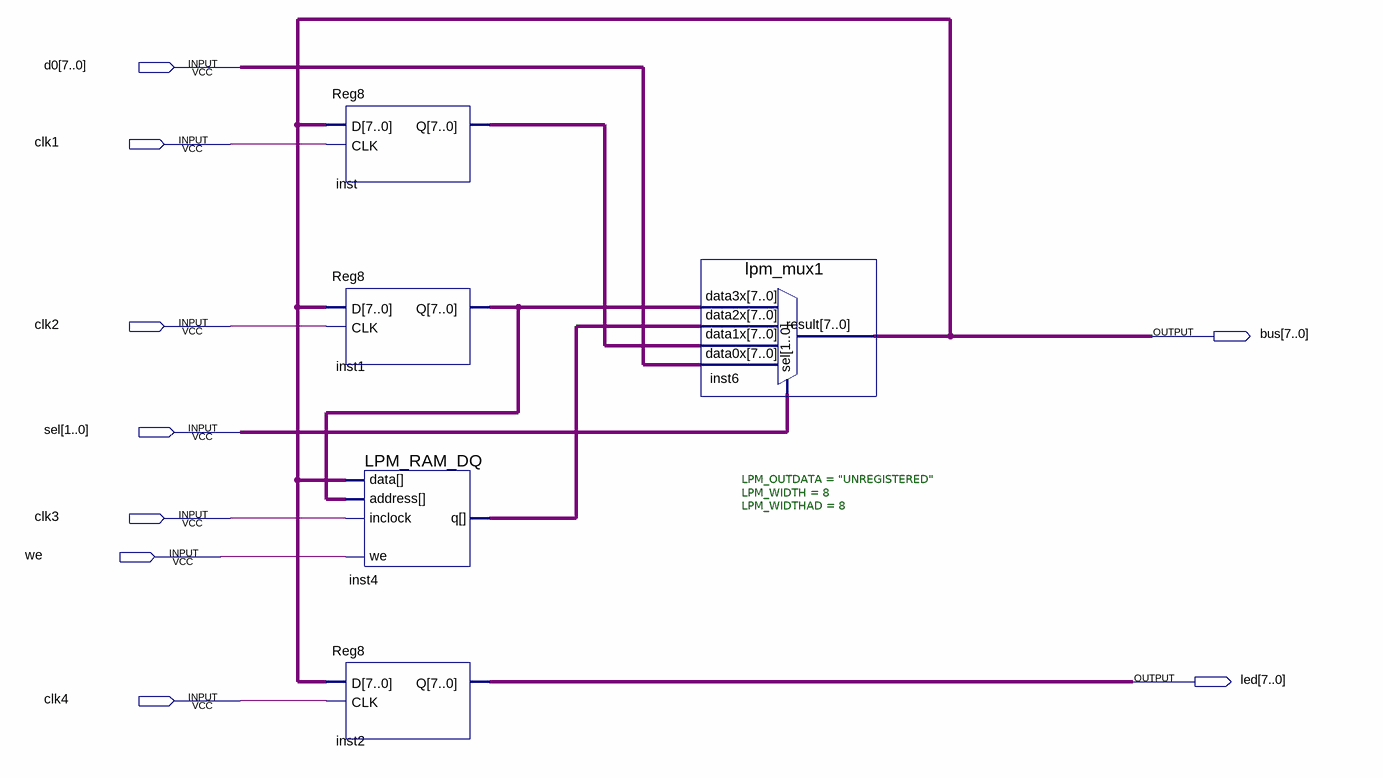
[diagram p0: schematic sheet]
// Quartus schematic bus1021.bdf as structural Verilog: 5 symbols, 9 pins
module bus1021 (
  input  [7:0] d0,
  input  clk1,
  input  clk2,
  input  [1:0] sel,
  input  clk3,
  input  we,
  input  clk4,
  output [7:0] bus,
  output [7:0] led
);

  wire [7:0] inst1_q, inst4_q, inst_q;

  Reg8 inst (.D(bus), .CLK(clk1), .Q(inst_q));
  Reg8 inst1 (.D(bus), .CLK(clk2), .Q(inst1_q));
  Reg8 inst2 (.D(bus), .CLK(clk4), .Q(led));
  LPM_RAM_DQ #(.LPM_OUTDATA("UNREGISTERED"), .LPM_WIDTH(8), .LPM_WIDTHAD(8)) inst4 (
    .address(inst1_q), .data(bus), .inclock(clk3), .we(we), .q(inst4_q));
  lpm_mux1 inst6 (.data3x(inst1_q), .data2x(inst4_q), .data1x(inst_q), .data0x(d0), .sel(sel), .result(bus));
endmodule
